# Altium schematic sheet main.SchDoc
size 420 x 297 mm; SheetNumber: 1; SheetTotal: 2
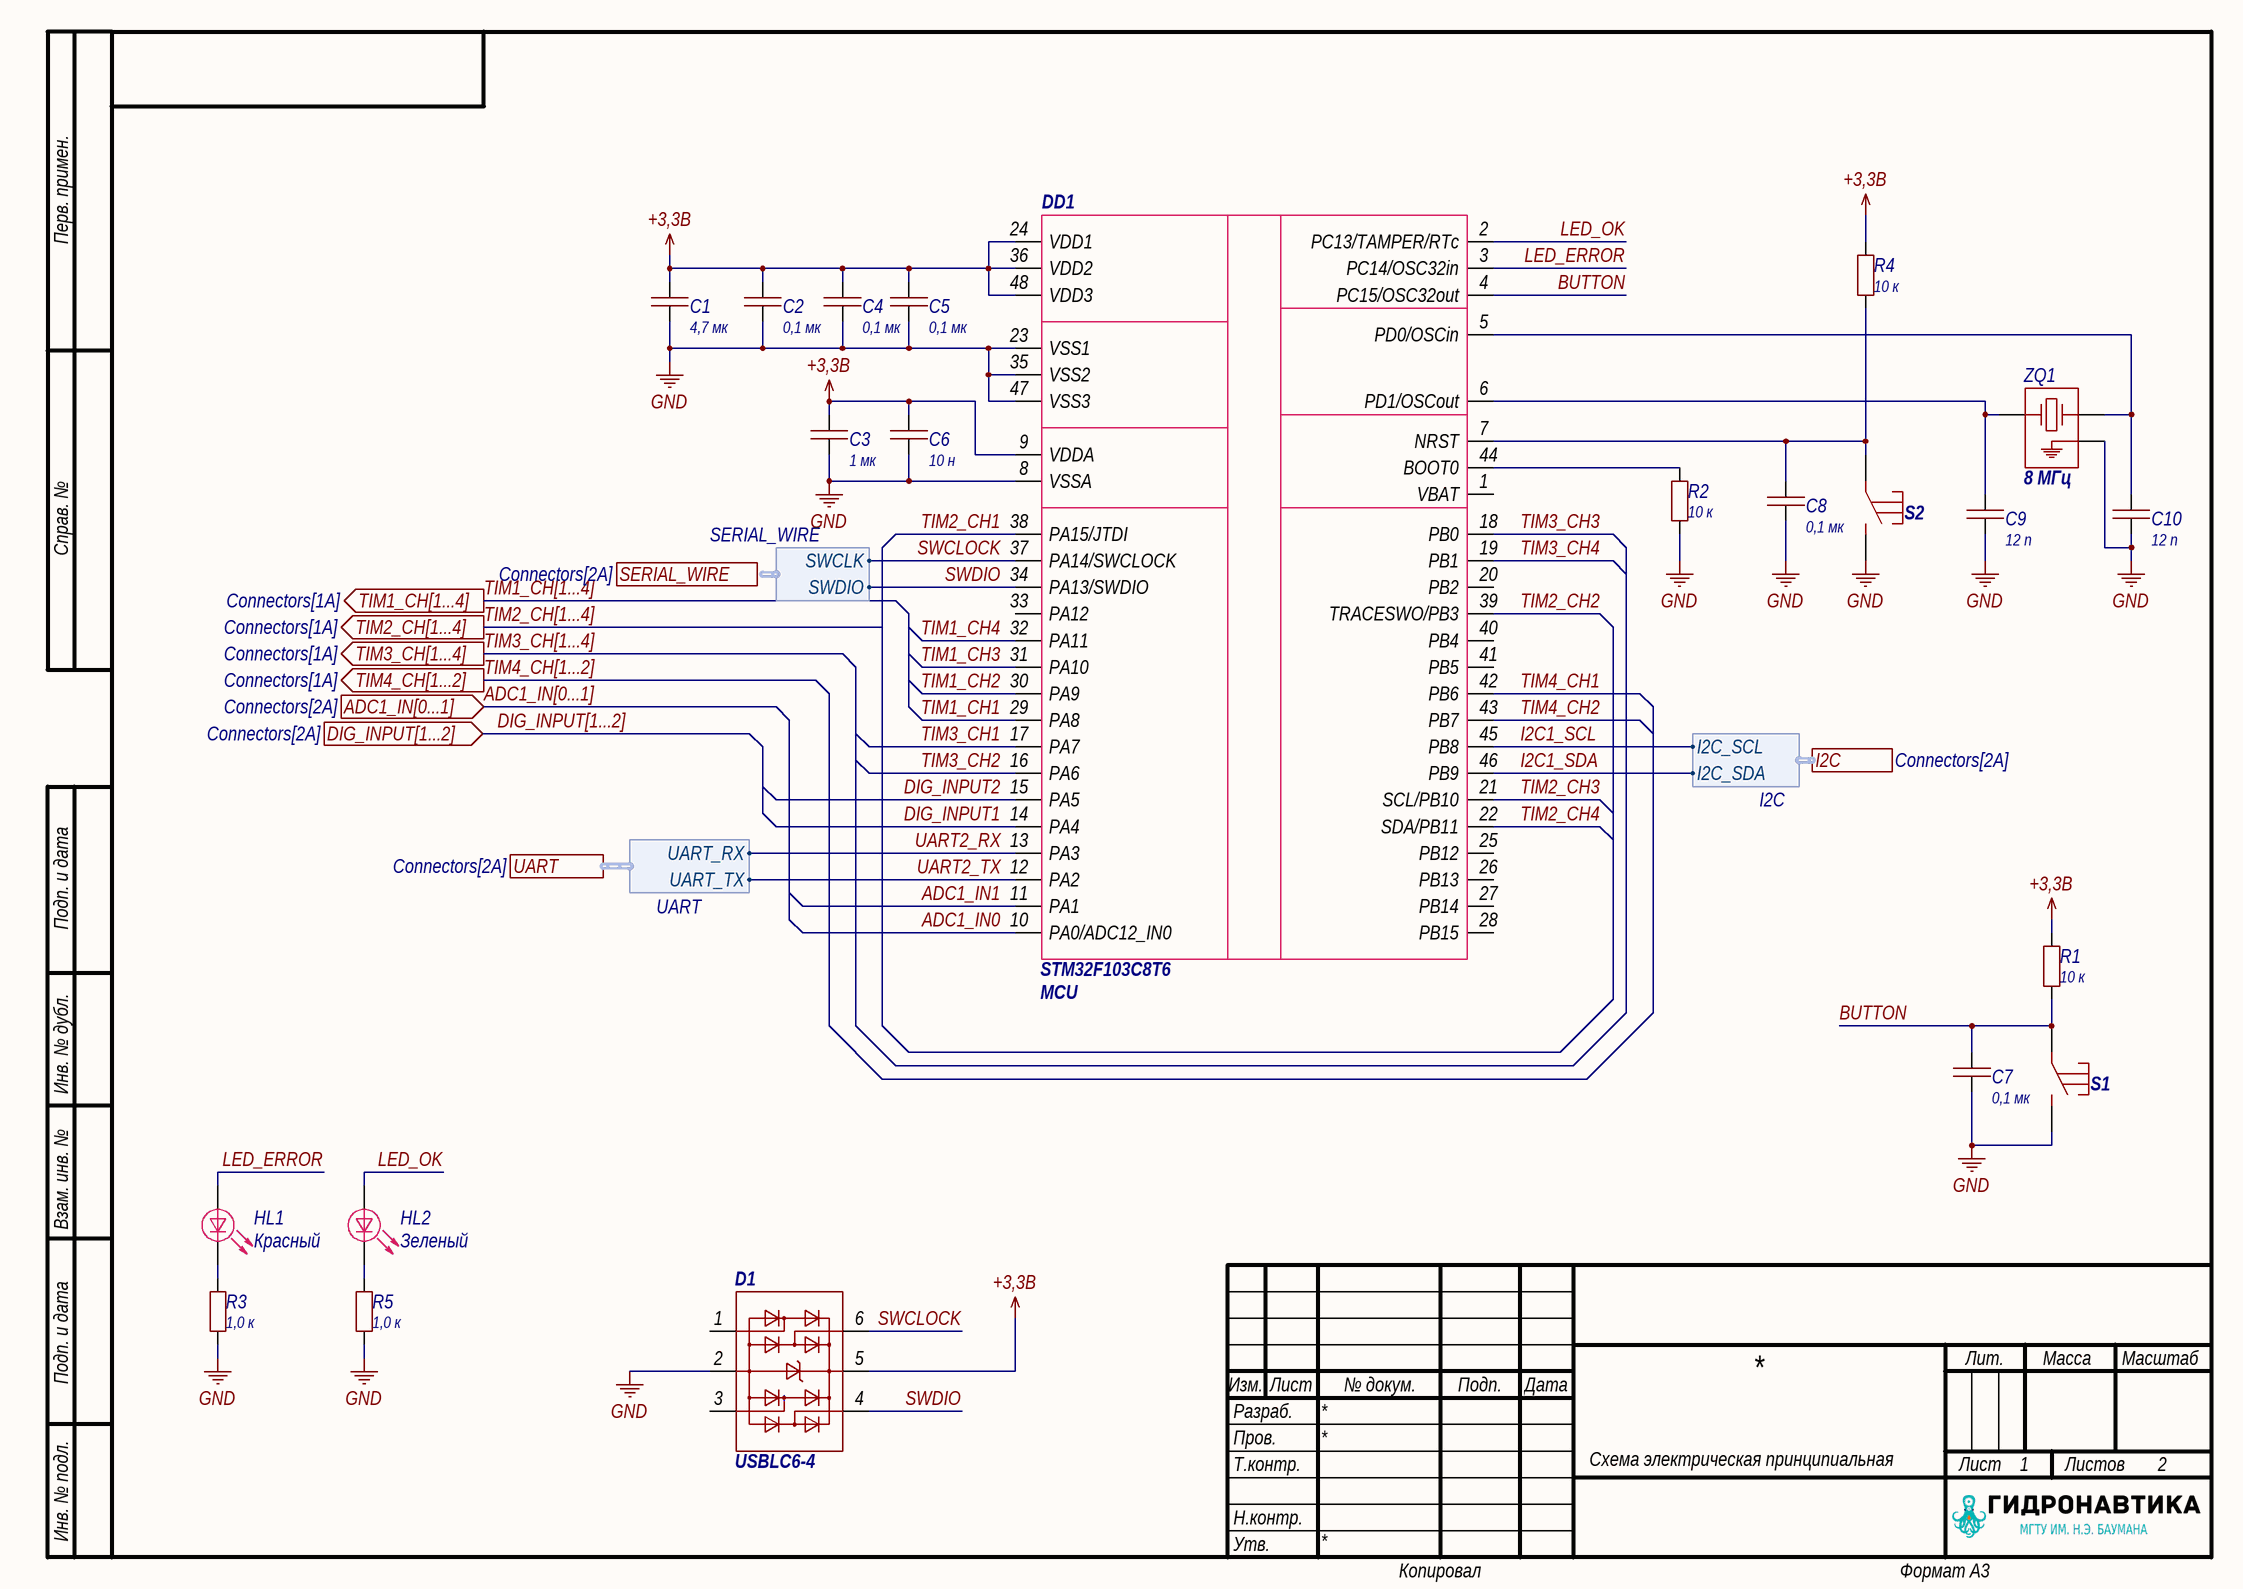
[diagram p0: main.SchDoc]

## Parts
C1  value 4,7 мк  [1206C]  (hidden comment: Capacitor)
C2  value 0,1 мк  [0603C]  (hidden comment: Capacitor)
C3  value 1 мк  [0603C]  (hidden comment: Capacitor)
C4  value 0,1 мк  [0603C]  (hidden comment: Capacitor)
C5  value 0,1 мк  [0603C]  (hidden comment: Capacitor)
C6  value 10 н  [0603C]  (hidden comment: Capacitor)
C7  value 0,1 мк  [0603C]  (hidden comment: Capacitor)
C8  value 0,1 мк  [0603C]  (hidden comment: Capacitor)
C9  value 12 п  [0603C]  (hidden comment: Capacitor)
C10  value 12 п  [0603C]  (hidden comment: Capacitor)
D1  USBLC6-4  [SOT23-6]
DD1  STM32F103C8T6  Value1: MCU  [LQFP48]
HL1  Color: Красный  [0805D]  (hidden comment: LED)
HL2  Color: Зеленый  [0805D]  (hidden comment: LED)
R1  value 10 к  [0603R]  (hidden comment: Resistor)
R2  value 10 к  [0603R]  (hidden comment: Resistor)
R3  value 1,0 к  [0603R]  (hidden comment: Resistor)
R4  value 10 к  [0603R]  (hidden comment: Resistor)
R5  value 1,0 к  [0603R]  (hidden comment: Resistor)
S1  Tact_button  [Button_SMD_10mm]  (value not drawn)
S2  Tact_button  [Button_SMD_10mm]  (value not drawn)
ZQ1  value 8 МГц  [QSMD3.2x2.5]  (hidden comment: XTAL_GND)

## Ports
ADC1_IN[0...1] (in, see Connectors[2A]), DIG_INPUT[1...2] (in, see Connectors[2A]), I2C (harness I2C, see Connectors[2A]), SERIAL_WIRE (harness SERIAL_WIRE, see Connectors[2A]), TIM1_CH[1...4] (out, see Connectors[1A]), TIM2_CH[1...4] (out, see Connectors[1A]), TIM3_CH[1...4] (out, see Connectors[1A]), TIM4_CH[1...2] (out, see Connectors[1A]), UART (harness UART, see Connectors[2A])

## Harnesses
UART: UART_RX, UART_TX
I2C: I2C_SCL, I2C_SDA
SERIAL_WIRE: SWCLK, SWDIO

## Nets
+3,3В: C1.2 C2.2 C3.2 C4.2 C5.2 C6.2 D1.5 DD1.9(VDDA) DD1.24(VDD1) DD1.36(VDD2) DD1.48(VDD3) R1.2 R4.2
GND: C1.1 C2.1 C3.1 C4.1 C5.1 C6.1 C7.1 C8.1 C9.1 C10.1 D1.2 DD1.8(VSSA) DD1.23(VSS1) DD1.35(VSS2) DD1.47(VSS3) R2.1 R3.1 R5.1 S1.2 S2.2 ZQ1.3
ADC1_IN0: DD1.10(PA0/ADC12_IN0)
ADC1_IN1: DD1.11(PA1)
BUTTON: C7.2 DD1.4(PC15/OSC32out) R1.1 S1.1
DIG_INPUT1: DD1.14(PA4)
DIG_INPUT2: DD1.15(PA5)
I2C1_SCL: DD1.45(PB8) ; port I2C.I2C_SCL
I2C1_SDA: DD1.46(PB9) ; port I2C.I2C_SDA
LED_ERROR: DD1.3(PC14/OSC32in) HL1.1
LED_OK: DD1.2(PC13/TAMPER/RTc) HL2.1
SWCLOCK: D1.6 DD1.37(PA14/SWCLOCK) ; harness SERIAL_WIRE.SWCLK
SWDIO: D1.4 DD1.34(PA13/SWDIO) ; harness SERIAL_WIRE.SWDIO
TIM1_CH1: DD1.29(PA8)
TIM1_CH2: DD1.30(PA9)
TIM1_CH3: DD1.31(PA10)
TIM1_CH4: DD1.32(PA11)
TIM2_CH1: DD1.38(PA15/JTDI)
TIM2_CH2: DD1.39(TRACESWO/PB3)
TIM2_CH3: DD1.21(SCL/PB10)
TIM2_CH4: DD1.22(SDA/PB11)
TIM3_CH1: DD1.17(PA7)
TIM3_CH2: DD1.16(PA6)
TIM3_CH3: DD1.18(PB0)
TIM3_CH4: DD1.19(PB1)
TIM4_CH1: DD1.42(PB6)
TIM4_CH2: DD1.43(PB7)
UART2_RX: DD1.13(PA3) ; port UART.UART_RX
UART2_TX: DD1.12(PA2) ; port UART.UART_TX
NetC8_2: C8.2 DD1.7(NRST) R4.1 S2.1
NetC9_2: C9.2 DD1.6(PD1/OSCout) ZQ1.1
NetC10_2: C10.2 DD1.5(PD0/OSCin) ZQ1.2
NetDD1_44: DD1.44(BOOT0) R2.2
NetHL1_2: HL1.2 R3.2
NetHL2_2: HL2.2 R5.2

Not connected (* = marked no-connect by the designer): D1 1(9) 3(11); DD1 1(VBAT) 20(PB2) 25(PB12) 26(PB13) 27(PB14) 28(PB15) 33(PA12) 40(PB4) 41(PB5)

## Buses and harness runs
bus ADC1_IN[0...1] = port ADC1_IN[0...1]
bus DIG_INPUT[1...2] = port DIG_INPUT[1...2]
bus TIM1_CH[1...4] = port TIM1_CH[1...4]
bus TIM2_CH[1...4] = port TIM2_CH[1...4]
bus TIM3_CH[1...4] = port TIM3_CH[1...4]
bus TIM4_CH[1...2] = port TIM4_CH[1...2]

## Notes on the sheet
- Перв. примен.
- Справ. №
- Подп. и дата
- Инв. № дубл.
- Взам. инв. №
- Разраб.
- Изм.
- Лист
- № докум.
- Подп.
- Дата
- Лит.
- Масса
- Масштаб
- Пров.
- Т.контр.
- Схема электрическая принципиальная
- Листов
- Инв. № подл.
- Утв.
- Н.контр.
- Копировал
- Формат А3

## Library data of the parts
C1 = Capacitor_4,7u_10_50V_X7R_1206C: Конденсатор; Library Path2: Schematic\Capacitor.SchLib; Tolerance: 0,1; Voltage (V): 50; Dielectric: X7R; Capacity (nF): 4700; Part Number: Capacitor_4,7u_10_50V_X7R_1206C
C2 C4 C5 C7 C8 = Capacitor_0,1u_10_50V_X7R_0603C: Конденсатор; Library Path2: Schematic\Capacitor.SchLib; Tolerance: 0,1; Voltage (V): 50; Dielectric: X7R; Capacity (nF): 100; Part Number: Capacitor_0,1u_10_50V_X7R_0603C
C3 = Capacitor_1u_10_50V_X7R_0603C: Конденсатор; Library Path2: Schematic\Capacitor.SchLib; Tolerance: 0,1; Voltage (V): 50; Dielectric: X7R; Capacity (nF): 1000; Part Number: Capacitor_1u_10_50V_X7R_0603C
C6 = Capacitor_10n_10_50V_X7R_0603C: Конденсатор; Library Path2: Schematic\Capacitor.SchLib; Tolerance: 0,1; Voltage (V): 50; Dielectric: X7R; Capacity (nF): 10; Part Number: Capacitor_10n_10_50V_X7R_0603C
C9 C10 = 0,1 мк: Конденсатор 12п; Part Number: Capacitor
D1 = USBLC6-4: Сборка защитных диодов для USB; ComponentLink1Description: Shop; ComponentLink1URL: https://www.chipdip.ru/product0/8001780508; Part Number: USBLC6-4
DD1 = STM32F103C8T6: Микроконтроллер; Manufacturer: ST Microelectronics; Rate: -0,3...4,0В; Shop: магазин с самой дешевой ценой; Notice: 48 пиновая версия STM32F103; Datasheet: http://www.st.com/content/ccc/resource/technical/document/datasheet/33/d4/6f/1d/df/0b/4c/6d/CD00161566.pdf/files/CD00161566.pdf/jcr:content/translations/en.CD00161566.pdf; Case: корпус; Part Number: STM32F103C8T6
HL1 HL2 = LED: Светодиод; Part Number: LED
R1 R2 R4 = Resistor_10k_1_0603: Резистор номиналом 10 кОм и точностью 1%; Power: *; Part Number: Resistor_10k_1_0603; Tolerance: 1%
R3 R5 = Resistor_1.0k_1_0603: Резистор номиналом 1,0 кОм и точностью 1%; Power: *; Part Number: Resistor_1.0k_1_0603; Tolerance: 1%
S1 S2 = Tact_button: Тактовая кнопка; Part Number: Tact_button
ZQ1 = XTAL_GND: Кварцевый резонатор с входом земли; Part Number: XTAL_GND